# Altium schematic sheet USER_IF.SchDoc
size A4; SheetNumber: 2; SheetTotal: 4
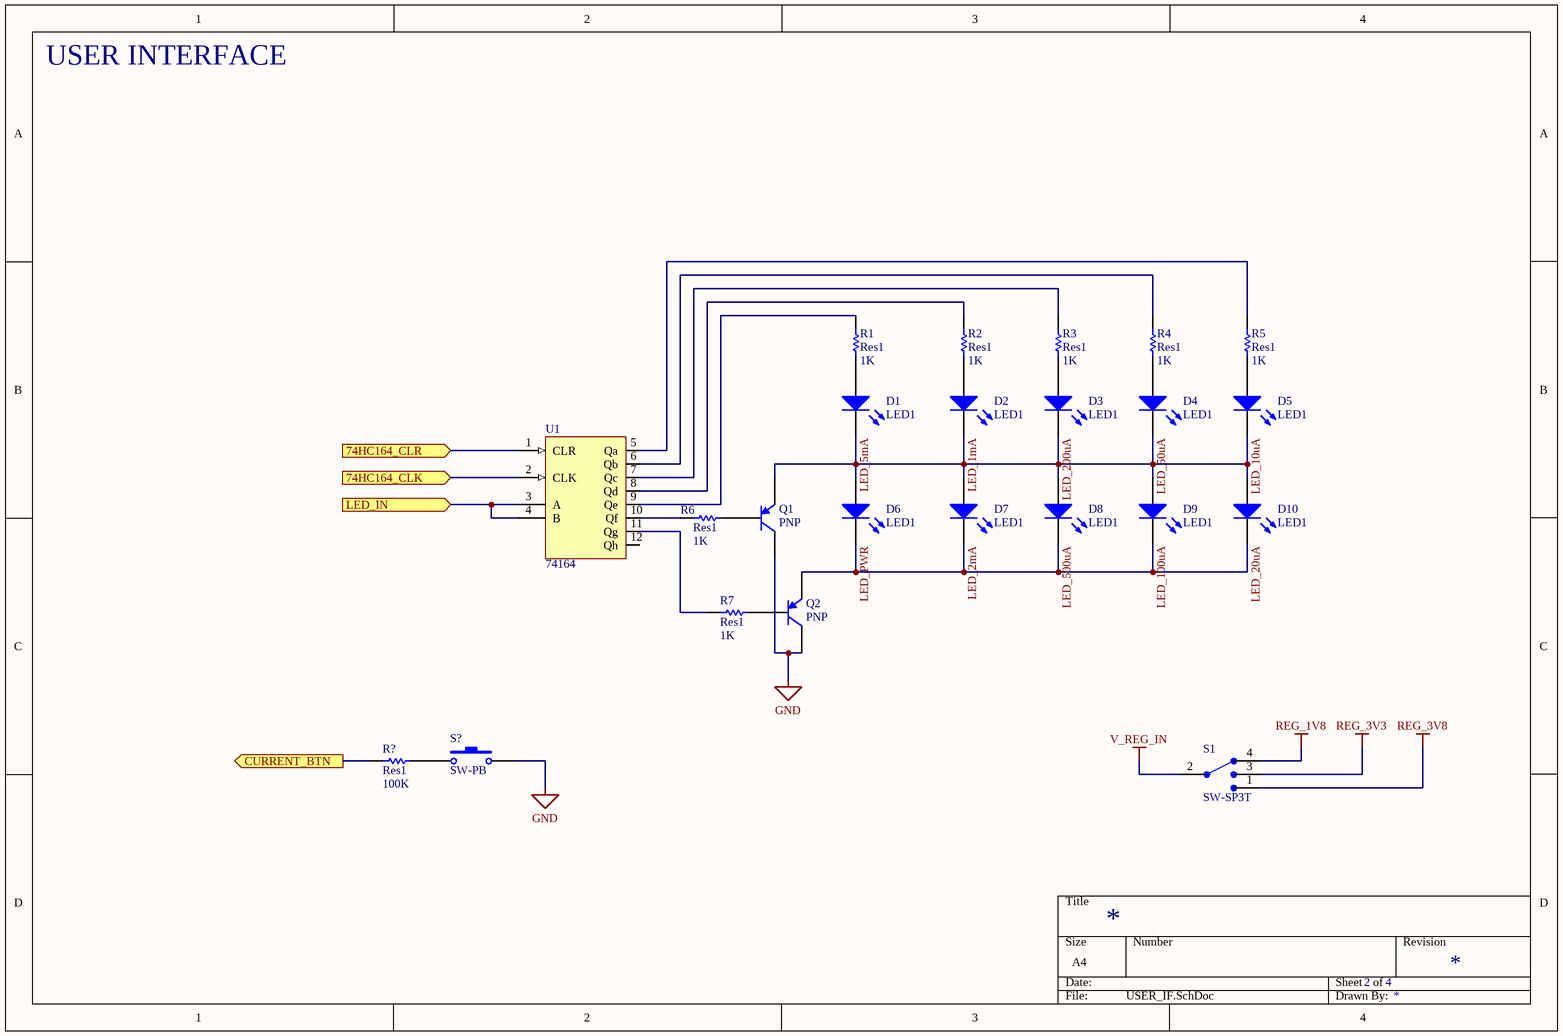
[diagram p0: USER_IF.SchDoc]

## Parts
D1  LED1  [LED-1]
D2  LED1  [LED-1]
D3  LED1  [LED-1]
D4  LED1  [LED-1]
D5  LED1  [LED-1]
D6  LED1  [LED-1]
D7  LED1  [LED-1]
D8  LED1  [LED-1]
D9  LED1  [LED-1]
D10  LED1  [LED-1]
Q1  PNP  [SOT-23B_N]
Q2  PNP  [SOT-23B_N]
R1  Res1  value 1K  [AXIAL-0.3]
R2  Res1  value 1K  [AXIAL-0.3]
R3  Res1  value 1K  [AXIAL-0.3]
R4  Res1  value 1K  [AXIAL-0.3]
R5  Res1  value 1K  [AXIAL-0.3]
R6  Res1  value 1K  [AXIAL-0.3]
R7  Res1  value 1K  [AXIAL-0.3]
R?  Res1  value 100K  [AXIAL-0.3]
S1  SW-SP3T  [SW_PCM13SMTR]
S?  SW-PB  [SPST-2]
U1  74164

## Ports
74HC164_CLK (in), 74HC164_CLR (in), CURRENT_BTN (out), LED_IN (in)

## Nets
GND: Q1.1(C) Q2.1(C) S?.2
REG_1V8: S1.4
REG_3V3: S1.3
REG_3V8: S1.1
V_REG_IN: S1.2
74HC164_CLK: U1.2(CLK) ; port 74HC164_CLK
74HC164_CLR: U1.1(CLR) ; port 74HC164_CLR
CURRENT_BTN: R?.1 ; port CURRENT_BTN
LED_10uA: D1.2(K) D2.2(K) D3.2(K) D4.2(K) D5.2(K) D6.1(A) D7.1(A) D8.1(A) D9.1(A) D10.1(A) Q1.3(E)  [also labelled LED_1mA, LED_200uA, LED_50uA, LED_5mA]
LED_100uA: D6.2(K) D7.2(K) D8.2(K) D9.2(K) D10.2(K) Q2.3(E)  [also labelled LED_20uA, LED_2mA, LED_500uA, LED_PWR]
LED_IN: U1.3(A) U1.4(B) ; port LED_IN
NetD1_1: D1.1(A) R1.1
NetD2_1: D2.1(A) R2.1
NetD3_1: D3.1(A) R3.1
NetD4_1: D4.1(A) R4.1
NetD5_1: D5.1(A) R5.1
NetQ1_2: Q1.2(B) R6.2
NetQ2_2: Q2.2(B) R7.2
NetR1_2: R1.2 U1.9(Qe)
NetR2_2: R2.2 U1.8(Qd)
NetR3_2: R3.2 U1.7(Qc)
NetR4_2: R4.2 U1.6(Qb)
NetR5_2: R5.2 U1.5(Qa)
NetR6_1: R6.1 U1.10(Qf)
NetR7_1: R7.1 U1.11(Qg)
NetR?_2: R?.2 S?.1

Not connected (* = marked no-connect by the designer): U1 12(Qh)

## Notes on the sheet
- USER INTERFACE

## Library data of the parts
D1-D10 = LED1: Typical RED GaAs LED; Published: 8-Jun-2000; LatestRevisionDate: 08-Jul-2005; LatestRevisionNote: Mech Layer 1 removed.; PackageReference: LED-1; Publisher: Altium Limited; PackageDescription: LED; 2 Leads
Q1 Q2 = PNP: PNP Bipolar Transistor; Published: 8-Jun-2000; LatestRevisionDate: 29-May-2009; LatestRevisionNote: IPC-7351 Footprint Added.; PackageVersion: Aug-1999; PackageReference: SOT-23B; Publisher: Altium Limited; PackageDescription: 3-Pin SOT-23 Package 0.95 mm Pitch, 2.4 mm Lead Span
R1-R7 R? = Res1: Resistor; Published: 8-Jun-2000; LatestRevisionDate: 17-Jul-2002; LatestRevisionNote: Re-released for DXP Platform.; PackageReference: AXIAL-0.3; Publisher: Altium Limited; PackageDescription: Axial Device, Thru-Hole; 2 Leads; 0.3 in Pin Spacing
S1 = SP3T: SP3T Subminiature Toggle Switch, Right Angle Mounting, Vertical Actuation; MP: PCM13SMTR; MF: C&K; Value: *; SnapEDA_Link: https://www.snapeda.com/parts/PCM13SMTR/C%26K/view-part/392684/?ref=snap; Availability: Unavailable; Package: None; Price: None
S? = SW-PB: Switch; Published: 24-Mar-1999; LatestRevisionDate: 17-Jul-2002; LatestRevisionNote: Re-released for DXP Platform.; PackageReference: SPST-2; Publisher: Altium Limited; PackageDescription: Switch; 2 Leads
U1 = 74HC164: 8-Bit Shift Register